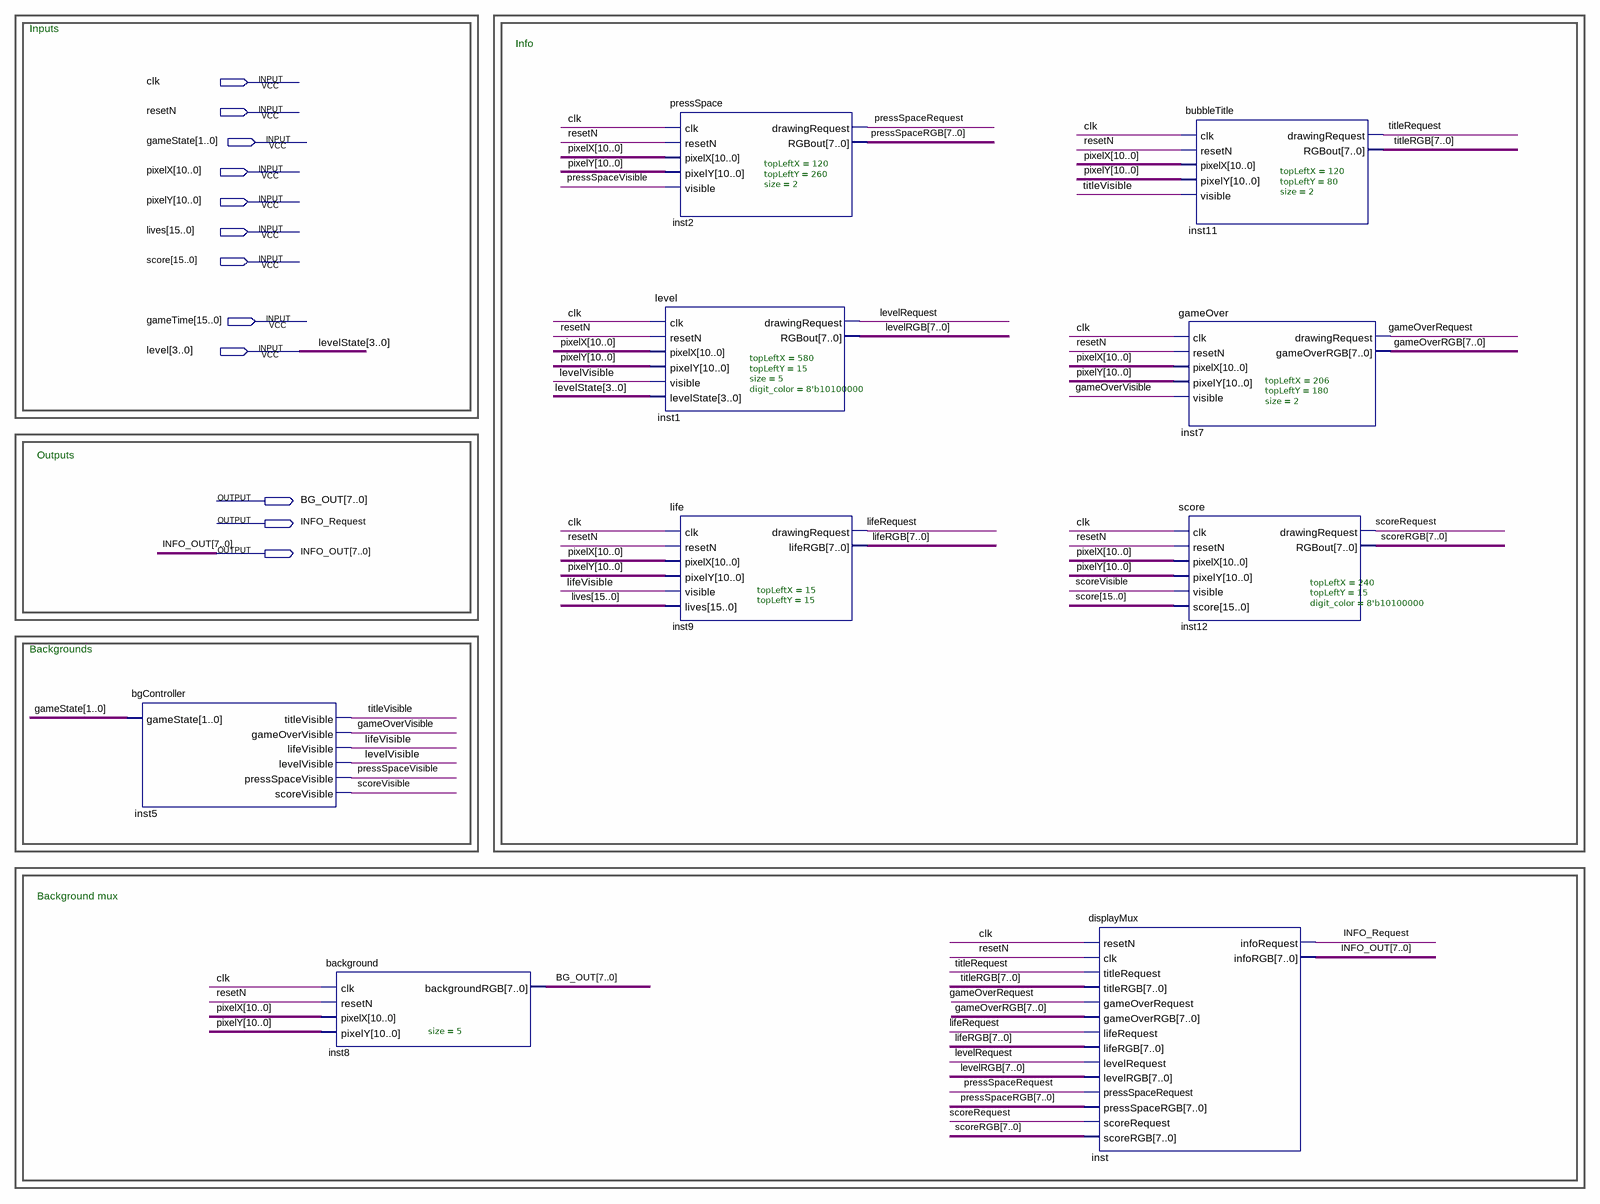
[diagram p0: schematic sheet]
// Quartus schematic backgrounds_TOP.bdf as structural Verilog: 9 symbols, 12 pins
module backgrounds_TOP (
  input  clk,
  input  resetN,
  input  [1:0] gameState,
  input  [10:0] pixelX,
  input  [10:0] pixelY,
  input  [15:0] lives,
  input  [15:0] score,
  input  [15:0] gameTime,
  input  [3:0] level,
  output [7:0] BG_OUT,
  output INFO_Request,
  output [7:0] INFO_OUT
);

  wire gameOverRequest, gameOverVisible, levelRequest, levelVisible, lifeRequest, lifeVisible,
       pressSpaceRequest, pressSpaceVisible, scoreRequest, scoreVisible, titleRequest, titleVisible;
  wire [7:0] gameOverRGB, levelRGB, lifeRGB, pressSpaceRGB, scoreRGB, titleRGB;

  bgController inst5 (
    .gameState(gameState), .titleVisible(titleVisible), .gameOverVisible(gameOverVisible),
    .lifeVisible(lifeVisible), .levelVisible(levelVisible), .pressSpaceVisible(pressSpaceVisible),
    .scoreVisible(scoreVisible));
  background #(.size(5)) inst8 (.clk(clk), .resetN(resetN), .pixelX(pixelX), .pixelY(pixelY), .backgroundRGB(BG_OUT));
  level #(.topLeftX(580), .topLeftY(15), .size(5), .digit_color(8'b10100000)) inst1 (
    .clk(clk), .resetN(resetN), .pixelX(pixelX), .pixelY(pixelY), .visible(levelVisible), .levelState(level),
    .drawingRequest(levelRequest), .RGBout(levelRGB));
  pressSpace #(.topLeftX(120), .topLeftY(260), .size(2)) inst2 (
    .clk(clk), .resetN(resetN), .pixelX(pixelX), .pixelY(pixelY), .visible(pressSpaceVisible),
    .drawingRequest(pressSpaceRequest), .RGBout(pressSpaceRGB));
  life #(.topLeftX(15), .topLeftY(15)) inst9 (
    .clk(clk), .resetN(resetN), .pixelX(pixelX), .pixelY(pixelY), .visible(lifeVisible), .lives(lives),
    .drawingRequest(lifeRequest), .lifeRGB(lifeRGB));
  displayMux inst (
    .resetN(clk), .clk(resetN), .titleRequest(titleRequest), .titleRGB(titleRGB),
    .gameOverRequest(gameOverRequest), .gameOverRGB(gameOverRGB), .lifeRequest(lifeRequest),
    .lifeRGB(lifeRGB), .levelRequest(levelRequest), .levelRGB(levelRGB),
    .pressSpaceRequest(pressSpaceRequest), .pressSpaceRGB(pressSpaceRGB), .scoreRequest(scoreRequest),
    .scoreRGB(scoreRGB), .infoRequest(INFO_Request), .infoRGB(INFO_OUT));
  bubbleTitle #(.topLeftX(120), .topLeftY(80), .size(2)) inst11 (
    .clk(clk), .resetN(resetN), .pixelX(pixelX), .pixelY(pixelY), .visible(titleVisible),
    .drawingRequest(titleRequest), .RGBout(titleRGB));
  gameOver #(.topLeftX(206), .topLeftY(180), .size(2)) inst7 (
    .clk(clk), .resetN(resetN), .pixelX(pixelX), .pixelY(pixelY), .visible(gameOverVisible),
    .drawingRequest(gameOverRequest), .gameOverRGB(gameOverRGB));
  score #(.topLeftX(240), .topLeftY(15), .digit_color(8'b10100000)) inst12 (
    .clk(clk), .resetN(resetN), .pixelX(pixelX), .pixelY(pixelY), .visible(scoreVisible), .score(score),
    .drawingRequest(scoreRequest), .RGBout(scoreRGB));

  // Other names for the same wires on the sheet: levelState[3:0] = level

  // Notes on the sheet:
  //   Inputs
  //   Info
  //   Outputs
  //   Backgrounds
  //   Background mux
endmodule
